# EAGLE design I2C-7311 (EAGLE 7.7.0)

## Sheet 1 of 2
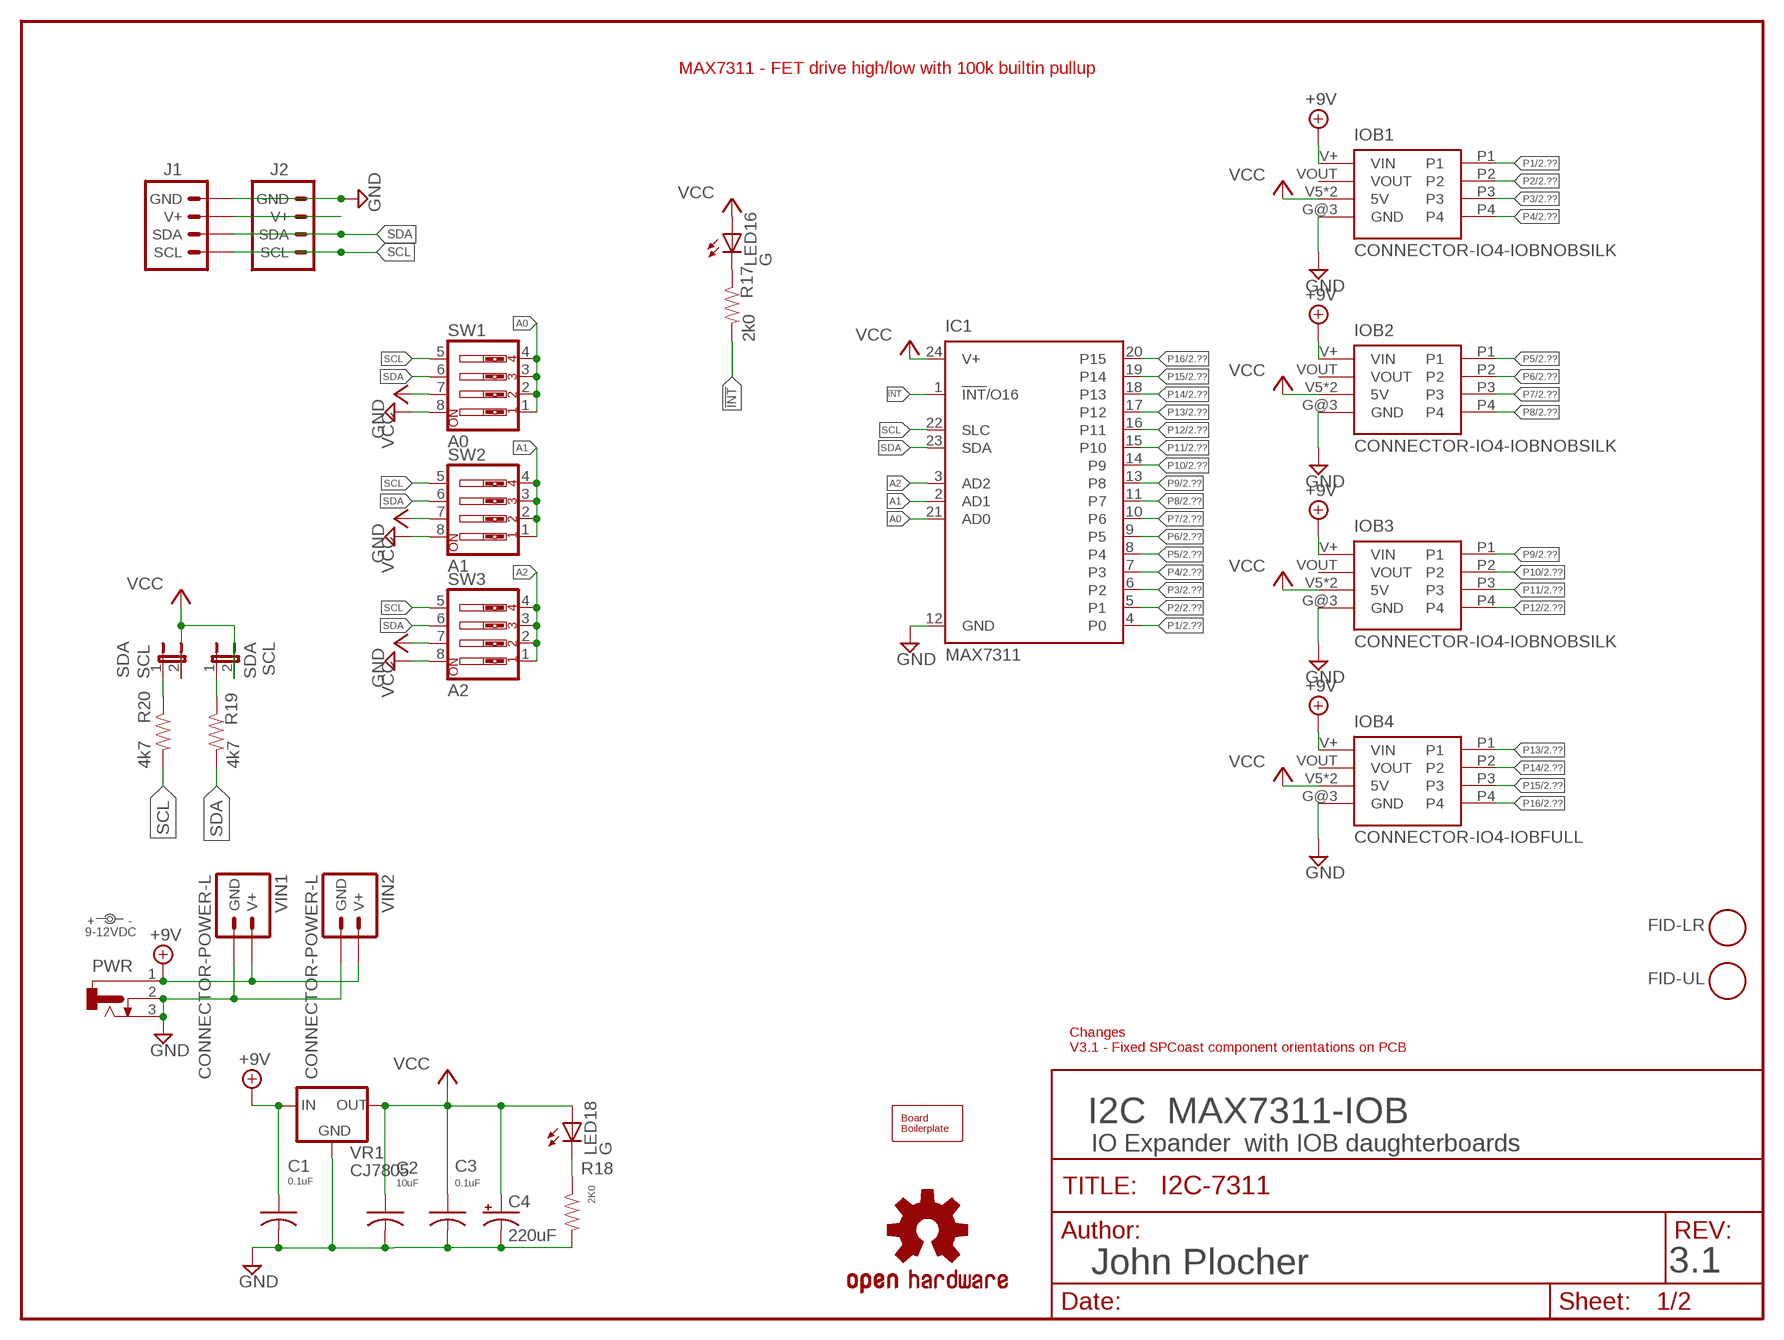
[diagram p0: schematic, sheet 1]

### Parts
BOARD1  BOARD80X100-IOB  [BOARD-DINRAIL-3.17IN-IOB]
C1  0.1uF  CAP0805  [0805-CAP]
C2  10uF  CAP0805  [0805-CAP]
C3  0.1uF  CAP0805  [0805-CAP]
C4  220uF  CAP-POL0810  [0810-CAP]
FID-LR  FIDUCIAL  [FIDUCIAL_1MM]
FID-UL  FIDUCIAL  [FIDUCIAL_1MM]
IC1  MAX7311  MAX73XX/AUG  [TSSOP24]
IOB1  CONNECTOR-IO4-IOBNOBSILK  [IOB-IO4-NOBOTSILK]
IOB2  CONNECTOR-IO4-IOBNOBSILK  [IOB-IO4-NOBOTSILK]
IOB3  CONNECTOR-IO4-IOBNOBSILK  [IOB-IO4-NOBOTSILK]
IOB4  CONNECTOR-IO4-IOBFULL  [IO4-IOB]
J1  CONNECTOR-I2CLEFT  [I2C-L]
J2  CONNECTOR-I2CLEFT  [I2C-L]
LED16  G  LED0603-LED  [0603-LED]
LED18  G  LED0603-LED  [0603-LED]
PWR  CONNECTOR-DC-POWER-RA  [DCJ0202]
R17  2k0  R0805-RES  [0805-RES]
R18  2K0  R0805-RES  [0805-RES]
R19  4k7  R0805-RES  [0805-RES]
R20  4k7  R0805-RES  [0805-RES]
SCL  SDA  JUMPER-2PTH_LOCK  [1X02_LOCK]
SDA  SCL  JUMPER-2PTH_LOCK  [1X02_LOCK]
SW1  A0  SW_DIP-4  [EDG-04]
SW2  A1  SW_DIP-4  [EDG-04]
SW3  A2  SW_DIP-4  [EDG-04]
U$1  OSHW-LOGOL  [OSHW-LOGO-L]
VIN  9-12VDC  DOC-POWER_LABEL  [PWR_LABEL]
VIN1  CONNECTOR-POWER-L  [POWER-R2]
VIN2  CONNECTOR-POWER-L  [POWER-R2]
VR1  CJ7805  VREG-DPAK-5  [TO-252]

### Nets
!INT [signals]: IC1.1(!INT!/O16) R17.2
+9V [Power]: C1.1 IOB1.V+(VIN) IOB2.V+(VIN) IOB3.V+(VIN) IOB4.V+(VIN) PWR.1 VIN1.V+ VIN1.V+@1(V+) VIN1.V+@2(V+) VIN1.V+@3(V+) VIN2.V+ VIN2.V+@1(V+) VIN2.V+@2(V+) VIN2.V+@3(V+) VR1.1(IN)
A0 [signals]: IC1.21(AD0) SW1.1 SW1.2 SW1.3 SW1.4
A1 [signals]: IC1.2(AD1) SW2.1 SW2.2 SW2.3 SW2.4
A2 [signals]: IC1.3(AD2) SW3.1 SW3.2 SW3.3 SW3.4
GND [Power]: C1.2 C2.2 C3.2 C4.- IC1.12(GND) IOB1.G@3(GND) IOB2.G@3(GND) IOB3.G@3(GND) IOB4.G@3(GND) J1.GND J1.GND@1(GND) J2.GND J2.GND@1(GND) PWR.2 PWR.3 R18.2 SW1.8 SW2.8 SW3.8 VIN1.GND VIN1.GND@1(GND) VIN1.GND@2(GND) VIN1.GND@3(GND) VIN2.GND VIN2.GND@1(GND) VIN2.GND@2(GND) VIN2.GND@3(GND) VR1.2(GND) ; also sheet 2
N$1: LED18.C R18.1
N$19 [signals]: R19.1 SCL.1
N$20 [signals]: R20.1 SDA.1
N$38: LED16.C R17.1
P1 [signals]: IC1.4(P0) IOB1.P1 ; also sheet 2
P2 [signals]: IC1.5(P1) IOB1.P2 ; also sheet 2
P3 [signals]: IC1.6(P2) IOB1.P3 ; also sheet 2
P4 [signals]: IC1.7(P3) IOB1.P4 ; also sheet 2
P5 [signals]: IC1.8(P4) IOB2.P1 ; also sheet 2
P6 [signals]: IC1.9(P5) IOB2.P2 ; also sheet 2
P7 [signals]: IC1.10(P6) IOB2.P3 ; also sheet 2
P8 [signals]: IC1.11(P7) IOB2.P4 ; also sheet 2
P9 [signals]: IC1.13(P8) IOB3.P1 ; also sheet 2
P10 [signals]: IC1.14(P9) IOB3.P2 ; also sheet 2
P11 [signals]: IC1.15(P10) IOB3.P3 ; also sheet 2
P12 [signals]: IC1.16(P11) IOB3.P4 ; also sheet 2
P13 [signals]: IC1.17(P12) IOB4.P1 ; also sheet 2
P14 [signals]: IC1.18(P13) IOB4.P2 ; also sheet 2
P15 [signals]: IC1.19(P14) IOB4.P3 ; also sheet 2
P16 [signals]: IC1.20(P15) IOB4.P4 ; also sheet 2
SCL [signals]: IC1.22(SLC) J1.SCL J1.SCL@1(SCL) J2.SCL J2.SCL@1(SCL) R20.2 SW1.5 SW2.5 SW3.5
SDA [signals]: IC1.23(SDA) J1.SDA J1.SDA@1(SDA) J2.SDA J2.SDA@1(SDA) R19.2 SW1.6 SW2.6 SW3.6
V+I2C: J1.V+ J1.V+@1(V+) J2.V+ J2.V+@1(V+)
VCC [Power]: C2.1 C3.1 C4.+ IC1.24(V+) IOB1.V5(5V) IOB1.V5@1(5V) IOB2.V5(5V) IOB2.V5@1(5V) IOB3.V5(5V) IOB3.V5@1(5V) IOB4.V5(5V) IOB4.V5@1(5V) LED16.A LED18.A SCL.2 SDA.2 SW1.7 SW2.7 SW3.7 VR1.3(OUT) ; also sheet 2
Unconnected: IOB1.VOUT IOB2.VOUT IOB3.VOUT IOB4.VOUT

### Notes on the sheet
- MAX7311 - FET drive high/low with 100k builtin pullup
- Changes
  V3.1 - Fixed SPCoast component orientations on PCB
- I2C  MAX7311-IOB
- IO Expander  with IOB daughterboards
- John Plocher | 3.1

## Sheet 2 of 2
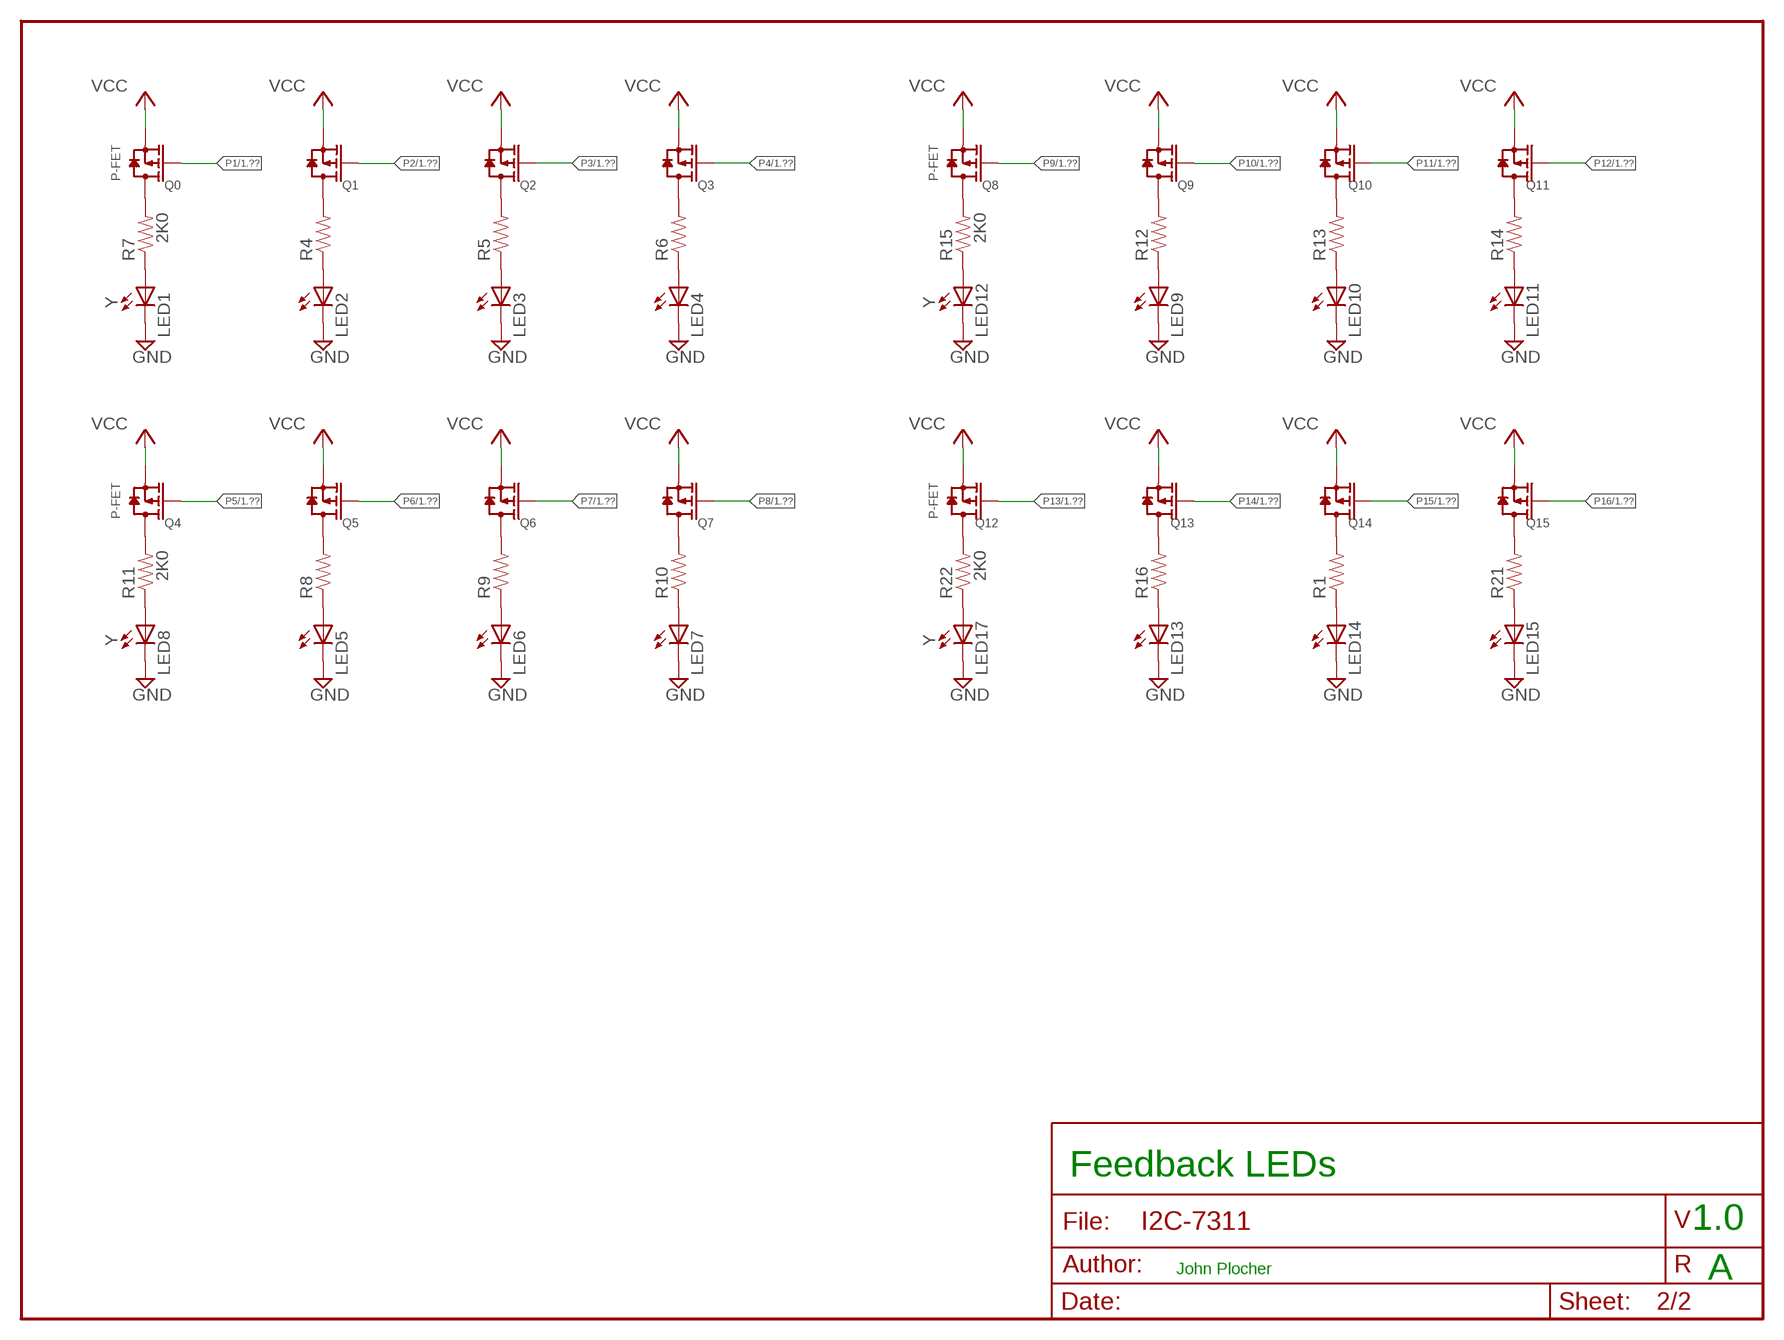
[diagram p1: schematic, sheet 2]

### Parts
LED1  Y  LED0603-LED  [0603-LED]
LED2  Y  LED0603-LED  [0603-LED]
LED3  Y  LED0603-LED  [0603-LED]
LED4  Y  LED0603-LED  [0603-LED]
LED5  Y  LED0603-LED  [0603-LED]
LED6  Y  LED0603-LED  [0603-LED]
LED7  Y  LED0603-LED  [0603-LED]
LED8  Y  LED0603-LED  [0603-LED]
LED9  Y  LED0603-LED  [0603-LED]
LED10  Y  LED0603-LED  [0603-LED]
LED11  Y  LED0603-LED  [0603-LED]
LED12  Y  LED0603-LED  [0603-LED]
LED13  Y  LED0603-LED  [0603-LED]
LED14  Y  LED0603-LED  [0603-LED]
LED15  Y  LED0603-LED  [0603-LED]
LED17  Y  LED0603-LED  [0603-LED]
Q0  P-FET  MOSFET-P-044021001  [SOT23]
Q1  P-FET  MOSFET-P-044021001  [SOT23]
Q2  P-FET  MOSFET-P-044021001  [SOT23]
Q3  P-FET  MOSFET-P-044021001  [SOT23]
Q4  P-FET  MOSFET-P-044021001  [SOT23]
Q5  P-FET  MOSFET-P-044021001  [SOT23]
Q6  P-FET  MOSFET-P-044021001  [SOT23]
Q7  P-FET  MOSFET-P-044021001  [SOT23]
Q8  P-FET  MOSFET-P-044021001  [SOT23]
Q9  P-FET  MOSFET-P-044021001  [SOT23]
Q10  P-FET  MOSFET-P-044021001  [SOT23]
Q11  P-FET  MOSFET-P-044021001  [SOT23]
Q12  P-FET  MOSFET-P-044021001  [SOT23]
Q13  P-FET  MOSFET-P-044021001  [SOT23]
Q14  P-FET  MOSFET-P-044021001  [SOT23]
Q15  P-FET  MOSFET-P-044021001  [SOT23]
R1  2K0  R0805-RES  [0805-RES]
R4  2K0  R0805-RES  [0805-RES]
R5  2K0  R0805-RES  [0805-RES]
R6  2K0  R0805-RES  [0805-RES]
R7  2K0  R0805-RES  [0805-RES]
R8  2K0  R0805-RES  [0805-RES]
R9  2K0  R0805-RES  [0805-RES]
R10  2K0  R0805-RES  [0805-RES]
R11  2K0  R0805-RES  [0805-RES]
R12  2K0  R0805-RES  [0805-RES]
R13  2K0  R0805-RES  [0805-RES]
R14  2K0  R0805-RES  [0805-RES]
R15  2K0  R0805-RES  [0805-RES]
R16  2K0  R0805-RES  [0805-RES]
R21  2K0  R0805-RES  [0805-RES]
R22  2K0  R0805-RES  [0805-RES]

### Nets
GND [Power]: LED1.C LED2.C LED3.C LED4.C LED5.C LED6.C LED7.C LED8.C LED9.C LED10.C LED11.C LED12.C LED13.C LED14.C LED15.C LED17.C ; also sheet 1
N$2: Q4.3(D) R11.2
N$3: Q5.3(D) R8.2
N$4: Q6.3(D) R9.2
N$5: Q7.3(D) R10.2
N$6: LED8.A R11.1
N$7: LED5.A R8.1
N$8: LED6.A R9.1
N$9: LED7.A R10.1
N$10: Q8.3(D) R15.2
N$11: Q9.3(D) R12.2
N$12: Q10.3(D) R13.2
N$13: Q11.3(D) R14.2
N$14: LED12.A R15.1
N$15: LED9.A R12.1
N$23: LED10.A R13.1
N$24: LED11.A R14.1
N$28: Q12.3(D) R22.2
N$29: Q13.3(D) R16.2
N$30: Q14.3(D) R1.2
N$31: Q15.3(D) R21.2
N$32: LED17.A R22.1
N$33: LED13.A R16.1
N$34: LED14.A R1.1
N$35: LED15.A R21.1
N$44: Q0.3(D) R7.2
N$45: Q1.3(D) R4.2
N$46: Q2.3(D) R5.2
N$47: Q3.3(D) R6.2
N$48: LED1.A R7.1
N$49: LED2.A R4.1
N$50: LED3.A R5.1
N$51: LED4.A R6.1
P1 [signals]: Q0.1(G) ; also sheet 1
P2 [signals]: Q1.1(G) ; also sheet 1
P3 [signals]: Q2.1(G) ; also sheet 1
P4 [signals]: Q3.1(G) ; also sheet 1
P5 [signals]: Q4.1(G) ; also sheet 1
P6 [signals]: Q5.1(G) ; also sheet 1
P7 [signals]: Q6.1(G) ; also sheet 1
P8 [signals]: Q7.1(G) ; also sheet 1
P9 [signals]: Q8.1(G) ; also sheet 1
P10 [signals]: Q9.1(G) ; also sheet 1
P11 [signals]: Q10.1(G) ; also sheet 1
P12 [signals]: Q11.1(G) ; also sheet 1
P13 [signals]: Q12.1(G) ; also sheet 1
P14 [signals]: Q13.1(G) ; also sheet 1
P15 [signals]: Q14.1(G) ; also sheet 1
P16 [signals]: Q15.1(G) ; also sheet 1
VCC [Power]: Q0.2(S) Q1.2(S) Q2.2(S) Q3.2(S) Q4.2(S) Q5.2(S) Q6.2(S) Q7.2(S) Q8.2(S) Q9.2(S) Q10.2(S) Q11.2(S) Q12.2(S) Q13.2(S) Q14.2(S) Q15.2(S) ; also sheet 1

### Notes on the sheet
- Feedback LEDs
- 1.0
- John Plocher
- A

## Library data of the parts
BOARD1 = SPCoast:BOARD
C1-C3 = SPCoast:CAP*
C4 = SPCoast:CAP-POL*
FID-LR FID-UL = SPCoast:FIDUCIAL: For use by pick and place machines to calibrate the vision/machine, 1mm By microbuilder.eu
IC1 = SPCoast:MAX73XX: 16-Port I/O Expander with LED Intensity Control, Interrupt, and Hot-Insertion Protection
IOB1-IOB4 = SPCoast:CONNECTOR-IO4-IOB
J1 J2 = SPCoast:CONNECTOR-I2C
LED1-LED18 = SPCoast:LED*
PWR = SPCoast:CONNECTOR-DC-POWER: DC POWER JACK
Q0 Q1-Q15 = SPCoast:MOSFET-P: CJ2305：SMD MOSFET P-CH 8V-4.1A
R1 R4-R22 = SPCoast:R*: Resistor Basic schematic elements and footprints for 0603, 1206, and PTH 1/10th watt (small) resistors.
SCL SDA = SPCoast:JUMPER-2: Jumper Basic 0.1" spaced jumper. Use with breakaway headers.
SW1-SW3 = SPCoast:SW_DIP-4: DIP SWITCH
U$1 = SparkFun:OSHW-LOGO: Open Source Hardware Logo This logo indicates the piece of hardware it is found on incorporates a OSHW license and/or adheres to the definition of open source hardware found here: http://freedomdefined.org/OSHW
VIN = SPCoast:DOC-POWER_LABEL
VIN1 VIN2 = SPCoast:CONNECTOR-POWER
VR1 = SPCoast:VREG-?-*: Voltage Regulator Standard linear regulator. 7805 uses IGO pinout LM1117 uses GOI pinout

## Net classes
0 default: width 0.254 mm, drill 0.4 mm, clearance 0.127 mm
1 Power: width 0.254 mm, drill 0.4 mm, clearance 0.127 mm
2 signals: width 0.254 mm, drill 0.4 mm, clearance 0.127 mm

## Board
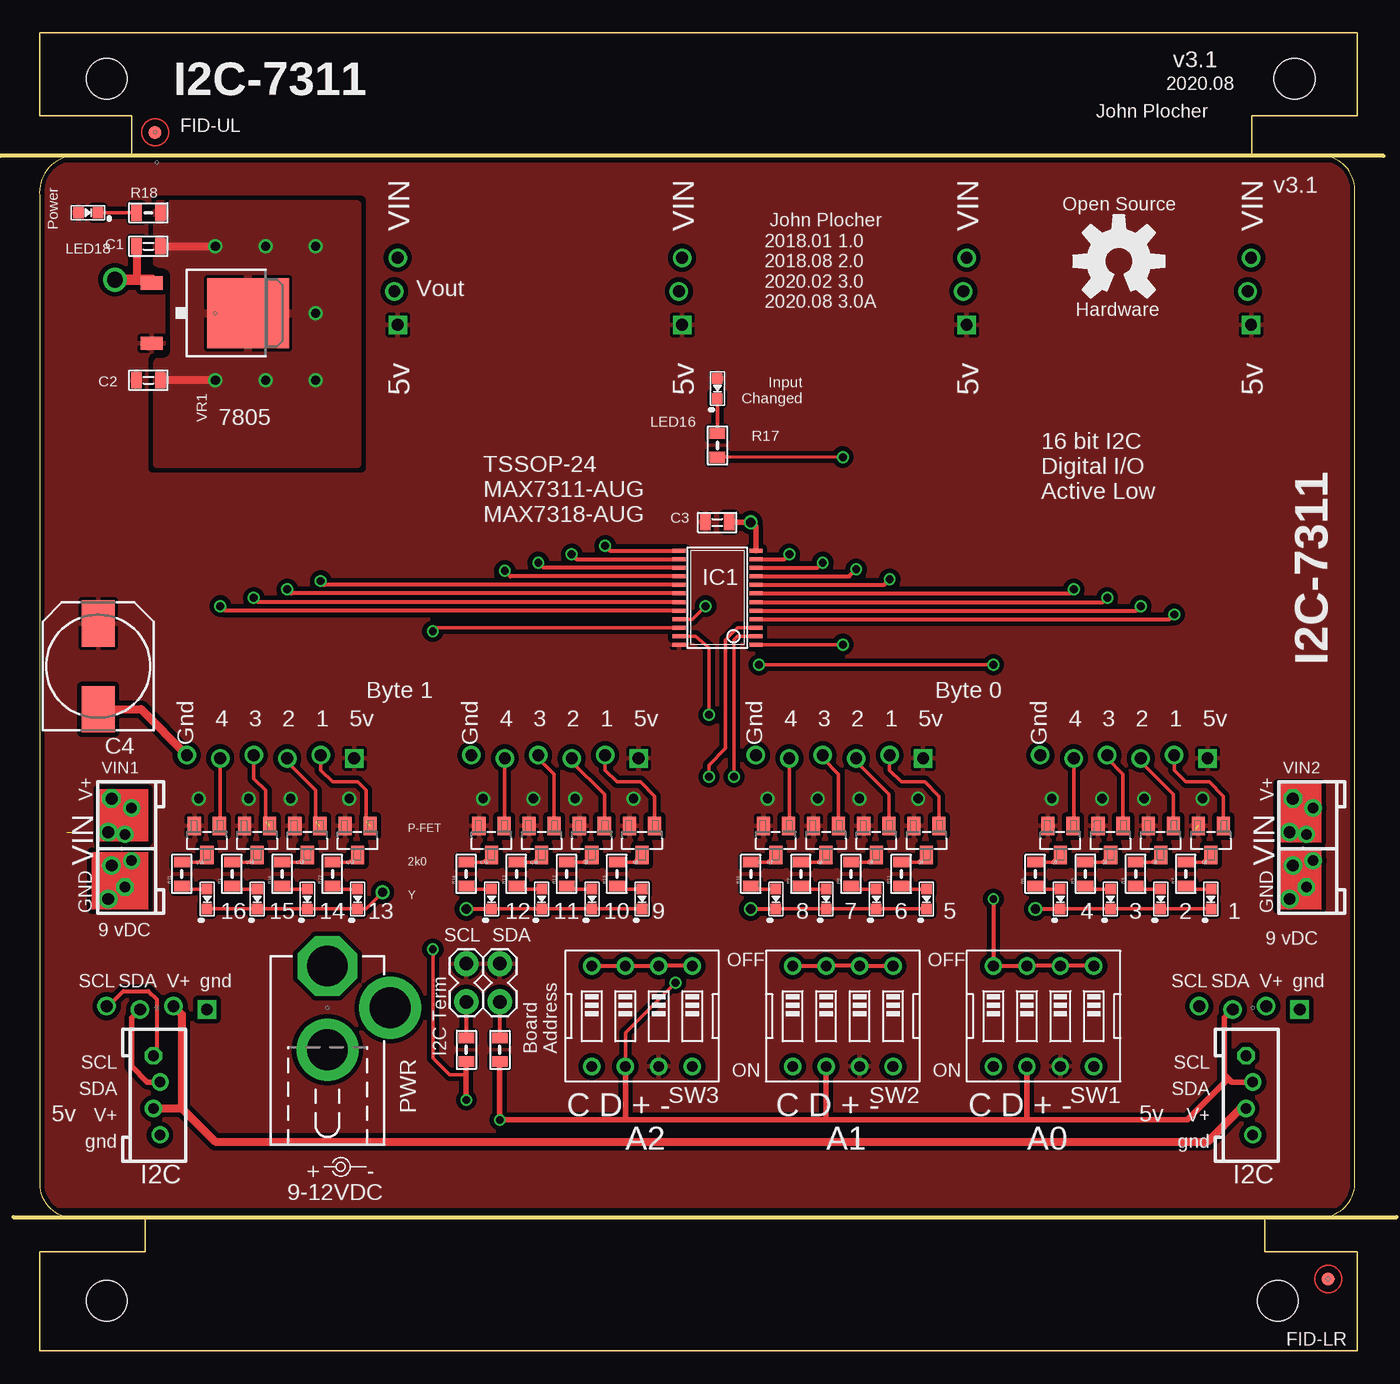
[diagram p2: board, top side]
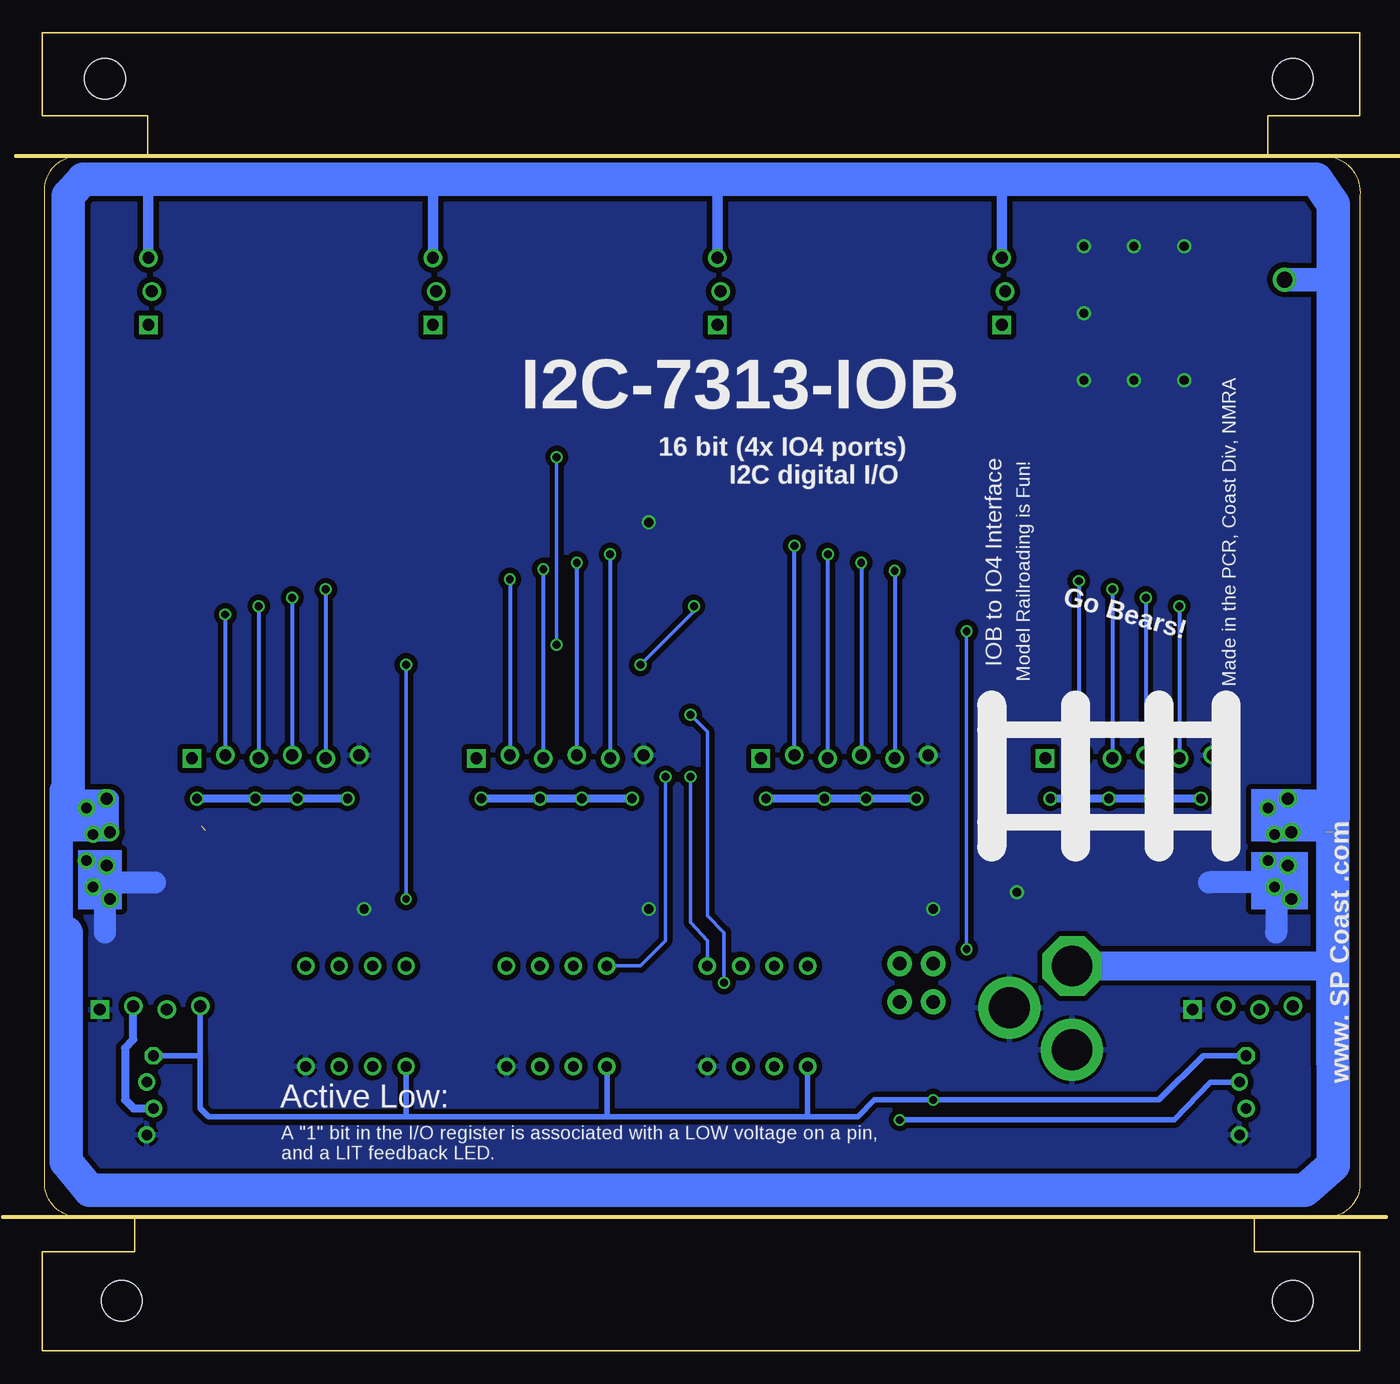
[diagram p3: board, bottom side, seen from below]

Size 100.01 x 100 mm. Coordinates in mm from the lower left corner, seen from the top.
Copper layers (1*16): Top 0.035mm / dielectric 1.5mm / Bottom 0.035mm
Design rules "Fusion_eagle_rule_v1.1": minimum track width 6mil, minimum drill 12mil, track to track 6mil, track to pad 6mil, pad to pad 6mil, via to via 6mil, smd to smd 0mil, copper to edge 10mil, drill to drill 10mil, minimum pad ring 10mil, minimum via ring 6mil, stop-mask expansion 2mil, vias tented up to drill 100mil, thermal gap 10mil

### Footprints (pad centres in the part's own frame; a part is rotated, then mirrored left to right if it is on the bottom)
BOARD-DINRAIL-3.17IN-IOB = hole 3.1: 5.08,96.52; 95.25,96.52; 5.08,3.81; 93.98,3.81
0805-CAP = smd 0.8 x 1.2: 1 -0.9,0; 2 0.9,0
0810-CAP = smd 3.5 x 2.5: + 3.25,0; - -3.25,0
FIDUCIAL_1MM = smd 1 x 1: 1 0,0
TSSOP24 = smd 0.305 x 0.991: 1 -3.575,-2.918; 2 -2.925,-2.918; 3 -2.275,-2.918; 4 -1.625,-2.918; 5 -0.975,-2.918; 6 -0.325,-2.918; 7 0.325,-2.918; 8 0.975,-2.918; 9 1.625,-2.918; 10 2.275,-2.918; 11 2.925,-2.918; 12 3.575,-2.918; 13 3.575,2.918; 14 2.925,2.918; 15 2.275,2.918; 16 1.625,2.918; 17 0.975,2.918; 18 0.325,2.918; 19 -0.325,2.918; 20 -0.975,2.918; 21 -1.625,2.918; 22 -2.275,2.918; 23 -2.925,2.918; 24 -3.575,2.918
IOB-IO4-NOBOTSILK = drill 0.9: G@3 44.958,2.286; P1 44.958,12.446; P2 45.212,9.906; P3 44.958,7.366; P4 45.212,4.826; V+ 7.239,18.288; VOUT 9.779,18.034 | drill 0.9 square: V5 12.319,18.288; V5@1 45.212,14.986
IO4-IOB = drill 0.9: G@3 44.958,2.286; P1 44.958,12.446; P2 45.212,9.906; P3 44.958,7.366; P4 45.212,4.826; V+ 7.239,18.288; VOUT 9.779,18.034 | drill 0.9 square: V5 12.319,18.288; V5@1 45.212,14.986
I2C-L = drill 0.9 square: GND 3.81,-0.127 | drill 0.8 pad 1.27: GND@1 0.254,-9.635; SDA@1 0.254,-5.635; V+@1 -0.254,-7.635 | drill 0.9: SCL -3.81,0.127; SDA -1.27,-0.127; V+ 1.27,0.127 | drill 0.8 pad 1.27 octagon: SCL@1 -0.254,-3.635
0603-LED = smd 0.8 x 0.8: A 0.75,0; C -0.75,0
DCJ0202 = drill 3.1 pad 4.5 octagon: 1 0,3.175 | drill 3.1 pad 4.7: 2 4.763,0; 3 0,-3.175
SOT23 = smd 1.4 x 1: 1 1.1,-0.95; 2 1.1,0.95; 3 -1.1,0
0805-RES = smd 0.8 x 1.2: 1 -0.9,0; 2 0.9,0
1X02_LOCK = drill 1.016 pad 1.88: 1 -0.178,0; 2 2.718,0
EDG-04 = drill 0.813: 1 -3.81,-3.81; 2 -1.27,-3.81; 3 1.27,-3.81; 4 3.81,-3.81; 5 3.81,3.81; 6 1.27,3.81; 7 -1.27,3.81; 8 -3.81,3.81
POWER-R2 = drill 0.9: GND -0.762,-1.27; GND@1 -1.016,-3.81; V+ -1.016,1.27 | drill 0.8 pad 1.27: GND@2 0.762,-0.904; V+@2 0.762,3.096; V+@3 0.254,1.096 | drill 0.8 pad 1.27 octagon: GND@3 0.254,-2.904 | drill 0.9 octagon: V+@1 -0.762,3.81
TO-252 = smd 1.651 x 1.016: 1 -4.826,2.286; 3 -4.826,-2.286 | smd 6.2 x 5.3: 2 2.5,0

### Placement (x,y rotation side)
BOARD1  0.01,0 0 top
C1  8.27,83.82 0 top
C2  8.27,73.66 0 top
C3  51.45,62.87 0 top
C4  4.46,51.94 90 top
FID-LR  97.8,5.46 0 top
FID-UL  8.78,92.46 0 top
IC1  51.45,57.15 90 top
IOB1  73.67,90.17 270 top
IOB2  52.08,90.17 270 top
IOB3  30.49,90.17 270 top
IOB4  8.9,90.17 270 top
J1  91.83,26.04 0 top
J2  8.9,26.04 0 top
LED1  88.91,34.29 90 top
LED2  85.1,34.29 90 top
LED3  81.29,34.29 90 top
LED4  77.48,34.29 90 top
LED5  63.51,34.29 90 top
LED6  59.7,34.29 90 top
LED7  55.89,34.29 90 top
LED8  67.32,34.29 90 top
LED9  41.92,34.29 90 top
LED10  38.11,34.29 90 top
LED11  34.3,34.29 90 top
LED12  45.73,34.29 90 top
LED13  20.33,34.29 90 top
LED14  16.52,34.29 90 top
LED15  12.71,34.29 90 top
LED16  51.45,73.03 90 top
LED17  24.14,34.29 90 top
LED18  3.7,86.36 180 top
PWR  21.86,26.04 0 top
Q0  88.91,38.73 90 top
Q1  85.1,38.73 90 top
Q2  81.29,38.73 90 top
Q3  77.48,38.73 90 top
Q4  67.32,38.73 90 top
Q5  63.51,38.73 90 top
Q6  59.7,38.73 90 top
Q7  55.89,38.73 90 top
Q8  45.73,38.73 90 top
Q9  41.92,38.73 90 top
Q10  38.11,38.73 90 top
Q11  34.3,38.73 90 top
Q12  24.14,38.73 90 top
Q13  20.33,38.73 90 top
Q14  16.52,38.73 90 top
Q15  12.71,38.73 90 top
R1  14.62,36.2 90 top
R4  83.2,36.2 90 top
R5  79.39,36.2 90 top
R6  75.58,36.2 90 top
R7  87.01,36.2 90 top
R8  61.61,36.2 90 top
R9  57.8,36.2 90 top
R10  53.99,36.2 90 top
R11  65.42,36.2 90 top
R12  40.02,36.2 90 top
R13  36.21,36.2 90 top
R14  32.4,36.2 90 top
R15  43.83,36.2 90 top
R16  18.43,36.2 90 top
R17  51.45,68.71 270 top
R18  8.27,86.36 0 top
R19  34.94,22.86 270 top
R20  32.4,22.86 270 top
R21  10.81,36.2 90 top
R22  22.24,36.2 90 top
SCL  34.94,26.67 90 top
SDA  32.4,26.67 90 top
SW1  76.21,25.4 180 top
SW2  60.97,25.4 180 top
SW3  45.73,25.4 180 top
U$1  81.93,82.68 0 top
VIN  22.87,13.97 90 top
VIN1  6.24,38.1 0 top
VIN2  95.9,38.1 0 top
VR1  13.35,78.74 0 top

### Tracks (layer width: path | path; a pad name or v marks a point on that pad's centre or on a via)
!INT  (via drill 0.6)
  Top 0.254: v60.97,53.59 54.39,53.59 IC1.1 | R17.2 52.08,67.86 v60.97,67.82
  Bottom 0.254: v60.97,67.82 v60.97,53.59
+9V  (via drill 1.2)  (1 unrouted)
  Top 0.406: 8.51,81.02 VR1.1 8.52,81.28
  Top 0.61: C1.1 7.37,81.28
  Top 0.813: v5.73,81.28 7.37,81.28 8.52,81.28
  Bottom 0.61: 98.06,41.78 97.37,41.1 97.34,41.1
  Bottom 0.813: IOB1.V+ 91.96,88.9 92.72,88.9 | IOB2.V+ 70.37,88.9 69.86,88.9 | IOB3.V+ 48.78,88.9 49.54,88.9 | IOB4.V+ 27.19,88.9 26.68,88.9 | 5.47,39.37 arc90 5.65,39.2 VIN1.V+@3 | VIN1.V+@2 VIN1.V+@1 | VIN2.V+ VIN2.V+@3
  Bottom 1.422: 2.68,40.64 2.68,41.91 VIN1.V+@1 | 5.47,39.37 VIN1.V+ 2.55,39.37 | 6.49,40.7 2.62,40.7 | 98.06,41.91 VIN2.V+@1 94.88,41.91 VIN2.V+ 97.8,39.37 97.8,40.64 95.26,40.64 95.26,41.2 VIN2.V+@2
  Bottom 1.778: v5.73,81.28 2.05,81.28 | 98.18,31.75 98.57,32 98.57,42.55
  Bottom 1.93: 2.05,41.27 2.62,40.7 2.68,40.64
  Bottom 2.184: PWR.1 2.05,29.21 arc-45 2.05,29.21
  Bottom 2.54: 98.06,41.78 98.06,41.91 98.06,87.63 96.91,88.9 92.72,88.9 69.86,88.9 49.54,88.9 26.68,88.9 3.32,88.9 2.05,87 2.05,81.28 2.05,41.27 2.06,39.36 2.05,29.21 2.05,14.1 4.2,12.19 96.41,12.19 98.18,14.35 98.18,31.75
A0  (via drill 0.55, 0.6)
  Top 0.254: IC1.21 49.57,55.52 v50.56,56.52 | v54.62,52.07 v72.4,52.07
  Top 0.305: SW1.1 SW1.2 SW1.3 SW1.4 v72.4,34.29
  Bottom 0.254: v50.56,56.52 50.56,56.13 v54.62,52.07 | v72.4,52.07 v72.4,34.29
A1  (via drill 0.6)
  Top 0.254: IC1.2 52.97,54.23 52.72,53.98 v52.72,43.56
  Top 0.305: SW2.1 SW2.2 SW2.3 SW2.4 56.76,29.21
  Bottom 0.254: v52.72,43.56 52.72,31.11 54.62,29.21 SW2.4
A2  (via drill 0.6)
  Top 0.254: IC1.3 52.98,54.88 52.08,53.98 52.08,45.72 50.81,44.45 v50.81,43.56
  Top 0.305: SW3.4 SW3.3 SW3.2 SW3.1
  Bottom 0.254: v50.81,43.56 50.81,32.51 49.54,31.11 SW3.1
GND  (via drill 0.7)
  Top 0.254: LED4.C LED3.C LED2.C LED1.C | LED7.C LED6.C LED5.C LED8.C | LED11.C LED10.C LED9.C LED12.C | LED15.C LED14.C LED13.C LED17.C 24.79,33.54 v26.05,34.8
  Top 0.305: LED4.C 77.48,33.53 v75.58,33.53 | LED7.C 55.89,33.53 v53.99,33.53 | LED11.C 34.3,33.53 v32.4,33.53 | LED15.C 12.71,33.53
  Top 0.406: C3.2 v53.99,62.87 54.37,62.49 IC1.12
  Top 0.61: v13.35,73.66 C2.2 | C1.2 v13.35,83.82 | C4.- 7.71,48.69 IOB4.G@3
  Bottom 0.813: VIN1.GND@1 6.13,35.2 VIN1.GND@3 | VIN2.GND@2 96.29,36.83 VIN2.GND | VIN2.GND@3 96.15,34.29 VIN2.GND@1
  Bottom 1.016: VIN1.GND@2 6.63,36.83 VIN1.GND 6.49,35.81 VIN1.GND@3 6.85,35.56 | VIN1.GND@1 5.58,34.29
  Bottom 1.676: 6.85,35.56 11.44,35.56 | VIN1.GND@3 6.36,35.07 6.36,31.75 | VIN2.GND 95.14,35.56 91.45,35.56 | VIN2.GND@1 arc-90 95.26,33.91 95.26,31.75
  other vias: 17.16,83.82 17.16,73.66 20.97,83.82 20.97,73.66 20.97,78.74
  pour Bottom (isolate 0.406, rank 2): 100.01,10 100.01,90 0.01,90 0.01,10
  pour Top (isolate 0.61): 8.9,67.31 24.14,67.31 24.14,87 8.9,87 8.9,82.55 10.17,81.28 10.17,76.2 8.9,74.93
N$1
  Top 0.254: R18.1 LED18.C
N$2
  Top 0.254: Q4.3 66.7,37.09 R11.2
N$3
  Top 0.254: Q5.3 62.89,37.09 R8.2
N$4
  Top 0.254: Q6.3 59.08,37.09 R9.2
N$5
  Top 0.254: Q7.3 55.27,37.09 R10.2
N$6
  Top 0.254: R11.1 65.67,35.04 LED8.A
N$7
  Top 0.254: R8.1 61.86,35.04 LED5.A
N$8
  Top 0.254: R9.1 58.05,35.04 LED6.A
N$9
  Top 0.254: R10.1 54.24,35.04 LED7.A
N$10
  Top 0.254: Q8.3 45.11,37.09 R15.2
N$11
  Top 0.254: Q9.3 41.3,37.09 R12.2
N$12
  Top 0.254: Q10.3 37.49,37.09 R13.2
N$13
  Top 0.254: Q11.3 33.68,37.09 R14.2
N$14
  Top 0.254: R15.1 44.08,35.04 LED12.A
N$15
  Top 0.254: R12.1 40.27,35.04 LED9.A
N$19
  Top 0.305: SCL.1 R19.1
N$20
  Top 0.305: SDA.1 R20.1
N$23
  Top 0.254: R13.1 36.46,35.04 LED10.A
N$24
  Top 0.254: R14.1 32.65,35.04 LED11.A
N$28
  Top 0.254: Q12.3 23.52,37.09 R22.2
N$29
  Top 0.254: Q13.3 19.71,37.09 R16.2
N$30
  Top 0.254: Q14.3 15.9,37.09 R1.2
N$31
  Top 0.254: Q15.3 12.09,37.09 R21.2
N$32
  Top 0.254: R22.1 22.49,35.04 LED17.A
N$33
  Top 0.254: R16.1 18.68,35.04 LED13.A
N$34
  Top 0.254: R1.1 14.87,35.04 LED14.A
N$35
  Top 0.254: R21.1 11.06,35.04 LED15.A
N$38
  Top 0.254: LED16.C R17.1
N$44
  Top 0.254: Q0.3 88.29,37.09 R7.2
N$45
  Top 0.254: Q1.3 84.48,37.09 R4.2
N$46
  Top 0.254: Q2.3 80.67,37.09 R5.2
N$47
  Top 0.254: Q3.3 76.86,37.09 R6.2
N$48
  Top 0.254: R7.1 87.26,35.04 LED1.A
N$49
  Top 0.254: R4.1 83.45,35.04 LED2.A
N$50
  Top 0.254: R5.1 79.64,35.04 LED3.A
N$51
  Top 0.254: R6.1 75.83,35.04 LED4.A
P1  (via drill 0.6)
  Top 0.254: Q0.1 89.86,42.1 88.79,43.18 87.01,43.18 86.12,44.07 IOB1.P1
  Top 0.305: IC1.4 85.76,55.52 v86.12,55.88
  Bottom 0.305: v86.12,55.88 IOB1.P1
P2  (via drill 0.6)
  Top 0.254: Q1.1 86.05,42.23 83.58,44.7 IOB1.P2
  Top 0.305: IC1.5 83.24,56.17 v83.58,56.52
  Bottom 0.305: v83.58,56.52 IOB1.P2
P3  (via drill 0.6)
  Top 0.254: Q2.1 82.24,43.75 81.04,44.96 IOB1.P3
  Top 0.305: IC1.6 80.71,56.83 v81.04,57.15
  Bottom 0.305: v81.04,57.15 IOB1.P3
P4  (via drill 0.6)
  Top 0.254: Q3.1 78.75,40.16 78.5,40.41 IOB1.P4
  Top 0.305: IC1.7 78.19,57.48 v78.5,57.78
  Bottom 0.305: v78.5,57.78 IOB1.P4
P5  (via drill 0.6)
  Top 0.254: Q4.1 68.27,42.1 67.2,43.18 65.42,43.18 64.53,44.07 IOB2.P1
  Top 0.305: IC1.8 64.11,58.12 v64.53,58.55
  Bottom 0.305: v64.53,58.55 IOB2.P1
P6  (via drill 0.6)
  Top 0.254: Q5.1 64.46,42.23 61.99,44.7 IOB2.P2
  Top 0.305: IC1.9 61.46,58.77 v61.99,59.31
  Bottom 0.305: v61.99,59.31 IOB2.P2
P7  (via drill 0.6)
  Top 0.254: Q6.1 60.65,43.75 59.45,44.96 IOB2.P3
  Top 0.305: IC1.10 59.06,59.42 v59.45,59.82
  Bottom 0.305: v59.45,59.82 IOB2.P3
P8  (via drill 0.6)
  Top 0.254: 56.91,39.9 Q7.1 57.16,40.16 56.91,40.41 IOB2.P4
  Top 0.305: IC1.11 56.53,60.08 v56.91,60.45
  Bottom 0.305: v56.91,60.45 IOB2.P4
P9  (via drill 0.6)
  Top 0.254: Q8.1 46.68,42.1 45.61,43.18 43.83,43.18 42.94,44.07 IOB3.P1
  Top 0.305: v42.94,61.09 43.3,60.73 IC1.13
  Bottom 0.305: IOB3.P1 v42.94,61.09
P10  (via drill 0.6)
  Top 0.254: Q9.1 42.87,42.23 40.4,44.7 IOB3.P2
  Top 0.305: v40.4,60.45 40.78,60.07 IC1.14
  Bottom 0.305: IOB3.P2 v40.4,60.45
P11  (via drill 0.6)
  Top 0.254: Q10.1 39.06,43.75 37.86,44.96 IOB3.P3
  Top 0.305: IC1.15 38.25,59.42 v37.86,59.82
  Bottom 0.305: v37.86,59.82 IOB3.P3
P12  (via drill 0.6)
  Top 0.254: Q11.1 35.57,40.16 35.32,40.41 IOB3.P4
  Top 0.305: IC1.16 35.73,58.77 v35.32,59.18
  Bottom 0.305: v35.32,59.18 IOB3.P4
P13  (via drill 0.6)  (1 unrouted)
  Top 0.254: 24.78,40.15 24.78,42.55 24.14,43.18 22.24,43.18 21.35,44.07 IOB4.P1
  Top 0.305: IC1.17 21.64,58.12 v21.35,58.42
  Bottom 0.305: v21.35,58.42 IOB4.P1
P14  (via drill 0.6)  (1 unrouted)
  Top 0.254: 20.97,40.15 20.97,42.55 18.81,44.7 IOB4.P2
  Top 0.305: IC1.18 19.12,57.48 v18.81,57.78
  Bottom 0.305: v18.81,57.78 IOB4.P2
P15  (via drill 0.6)  (1 unrouted)
  Top 0.254: 17.16,40.15 17.16,42.55 16.27,43.43 IOB4.P3
  Top 0.305: IC1.19 16.59,56.83 v16.27,57.15
  Bottom 0.305: v16.27,57.15 IOB4.P3
P16  (via drill 0.6)
  Top 0.254: Q15.1 13.73,39.9 IOB4.P4
  Top 0.305: IC1.20 14.07,56.17 v13.73,56.52
  Bottom 0.305: v13.73,56.52 IOB4.P4
SCL  (via drill 0.55, 0.6)
  Top 0.254: IC1.22 30.12,54.88 v29.86,54.61 | v29.86,30.48 29.86,22.23 31.13,20.95 32.4,20.95
  Top 0.305: J2.SCL 5.22,26.16 6.36,27.3 8.27,27.3 8.9,26.67 8.9,22.65 J2.SCL@1
  Top 0.406: R20.2 32.4,20.95 v32.4,19.05
  Bottom 0.254: v29.86,54.61 v29.86,30.48
  Bottom 0.305: 30.57,19.1 30.62,19.05
  Bottom 0.406: J2.SCL@1 11.9,22.4 15.25,19.05 30.62,19.05 v32.4,19.05 36.84,19.05 38.11,17.78 41.92,17.78 | 41.92,17.78 SW3.5 | 41.92,17.78 57.16,17.78 | 57.16,17.78 SW2.5 | 72.4,17.78 57.16,17.78 | 72.4,17.78 SW1.5 | 88.02,22.4 J1.SCL | 88.02,22.4 88.02,18.41 87.39,17.78 72.4,17.78 | J1.SCL@1 88.02,22.4
SDA  (via drill 0.55, 0.6)
  Top 0.254: IC1.23 49.79,54.23 50.81,53.34 v50.81,48.26 | v48.27,27.94 44.46,24.13 SW3.6
  Top 0.406: J2.SDA 7,25.27 7,21.59 8.19,20.4 J2.SDA@1 | J1.SDA 89.93,25.27 89.93,20.95 90.25,20.64 | 90.25,20.64 90.48,20.4 J1.SDA@1 | R19.2 v34.94,17.53 44.46,17.53 | 44.46,17.53 SW3.6 | 59.7,17.53 SW2.6 | 59.7,17.53 44.46,17.53 | 74.94,17.53 SW1.6 | 74.94,17.53 59.7,17.53 | 90.25,20.64 87.14,17.53 74.94,17.53
  Bottom 0.254: v50.81,48.26 49.54,46.99 49.54,33.02 48.27,31.75 v48.27,27.94
  Bottom 0.406: J2.SDA@1 11.36,20.4 14.11,17.53 v34.94,17.53
V+I2C
  Top 0.61: J2.V+ 10.81,25.53 10.81,18.41 | J2.V+@1 8.66,18.41 10.81,18.41 | 10.81,18.41 13.35,15.88 88.66,15.88 91.18,18.4 J1.V+@1
  Bottom 0.61: J1.V+@1 93.09,18.4 93.74,19.05 93.74,22.99 93.1,23.62 J1.V+
VCC  (via drill 0.7)  (1 unrouted)
  Top 0.254: 87.9,40.39 87.96,40.32 | 84.21,40.39 84.15,40.33 | 80.4,40.39 80.34,40.33 80.48,40.33 80.66,40.15 | 76.59,40.39 76.53,40.33 76.67,40.33 76.85,40.15 Q3.2 | 83.83,40.16 Q1.2 | 66.31,40.39 66.37,40.32 | 62.62,40.39 62.56,40.33 | 55,40.39 54.94,40.33 55.08,40.33 55.26,40.15 | 44.72,40.39 44.78,40.32 44.46,40 | 41.03,40.39 40.97,40.33 | 37.22,40.39 37.16,40.33 37.3,40.33 37.48,40.15 | 33.41,40.39 33.35,40.33 33.49,40.33 | 11.82,40.39 11.76,40.33 | Q4.2 66.05,39.52 66.05,39.37 | 87.64,39.52 87.64,39.37
  Top 0.61: 8.27,76.2 VR1.3
  Bottom 0.61: v76.85,41.91 v80.66,41.91 v83.83,41.91 v88.28,41.91 | v55.26,41.91 v59.07,41.91 v62.24,41.91 v66.69,41.91 | v33.67,41.91 v37.48,41.91 v40.65,41.91 v45.1,41.91 | v12.08,41.91 v15.89,41.91 v19.06,41.91 v23.51,41.91
  pour Top (isolate 0.356, rank 2): 100.01,11 100.01,90 0.01,90 0.01,11
(copper drawn outside any net)
  shapes: Bottom area x3, Top area x4

### Text on the board
tPlace: v3.1 | 2020.08 | John Plocher | v3.1 | Open Source | Power | John Plocher | Vout | 2018.01 1.0 / 2018.08 2.0 / 2020.02 3.0 / 2020.08 3.0A | Hardware | Input / Changed | 7805 | 16 bit I2C / Digital I/O / Active Low | TSSOP-24 / MAX7311-AUG / MAX7318-AUG | Byte 1 | Byte 0 | P-FET | 2k0 | Y | 16 | 15 | 14 | 13 | 12 | 11 | 10 | 9 | 8 | 7 | 6 | 5 | 4 | 3 | 2 | 1 | 9 vDC | 9 vDC | OFF | OFF | Board / Address | I2C Term | ON | ON | C D + - | C D + - | C D + - | 5v | 5v | A2 | A1 | A0
bPlace: I2C-7313-IOB | 16 bit (4x IO4 ports) / I2C digital I/O | Go Bears! | www. SP Coast .com | Active Low: | A "1" bit in the I/O register is associated with a LOW voltage on a pin, / and a LIT feedback LED.
Document: 3.0A - Fixed C-POL, LED and VREG library component orientations to match default reel orientation, no PCB changes